# EAGLE design LAOS10105 (EAGLE 5.11)
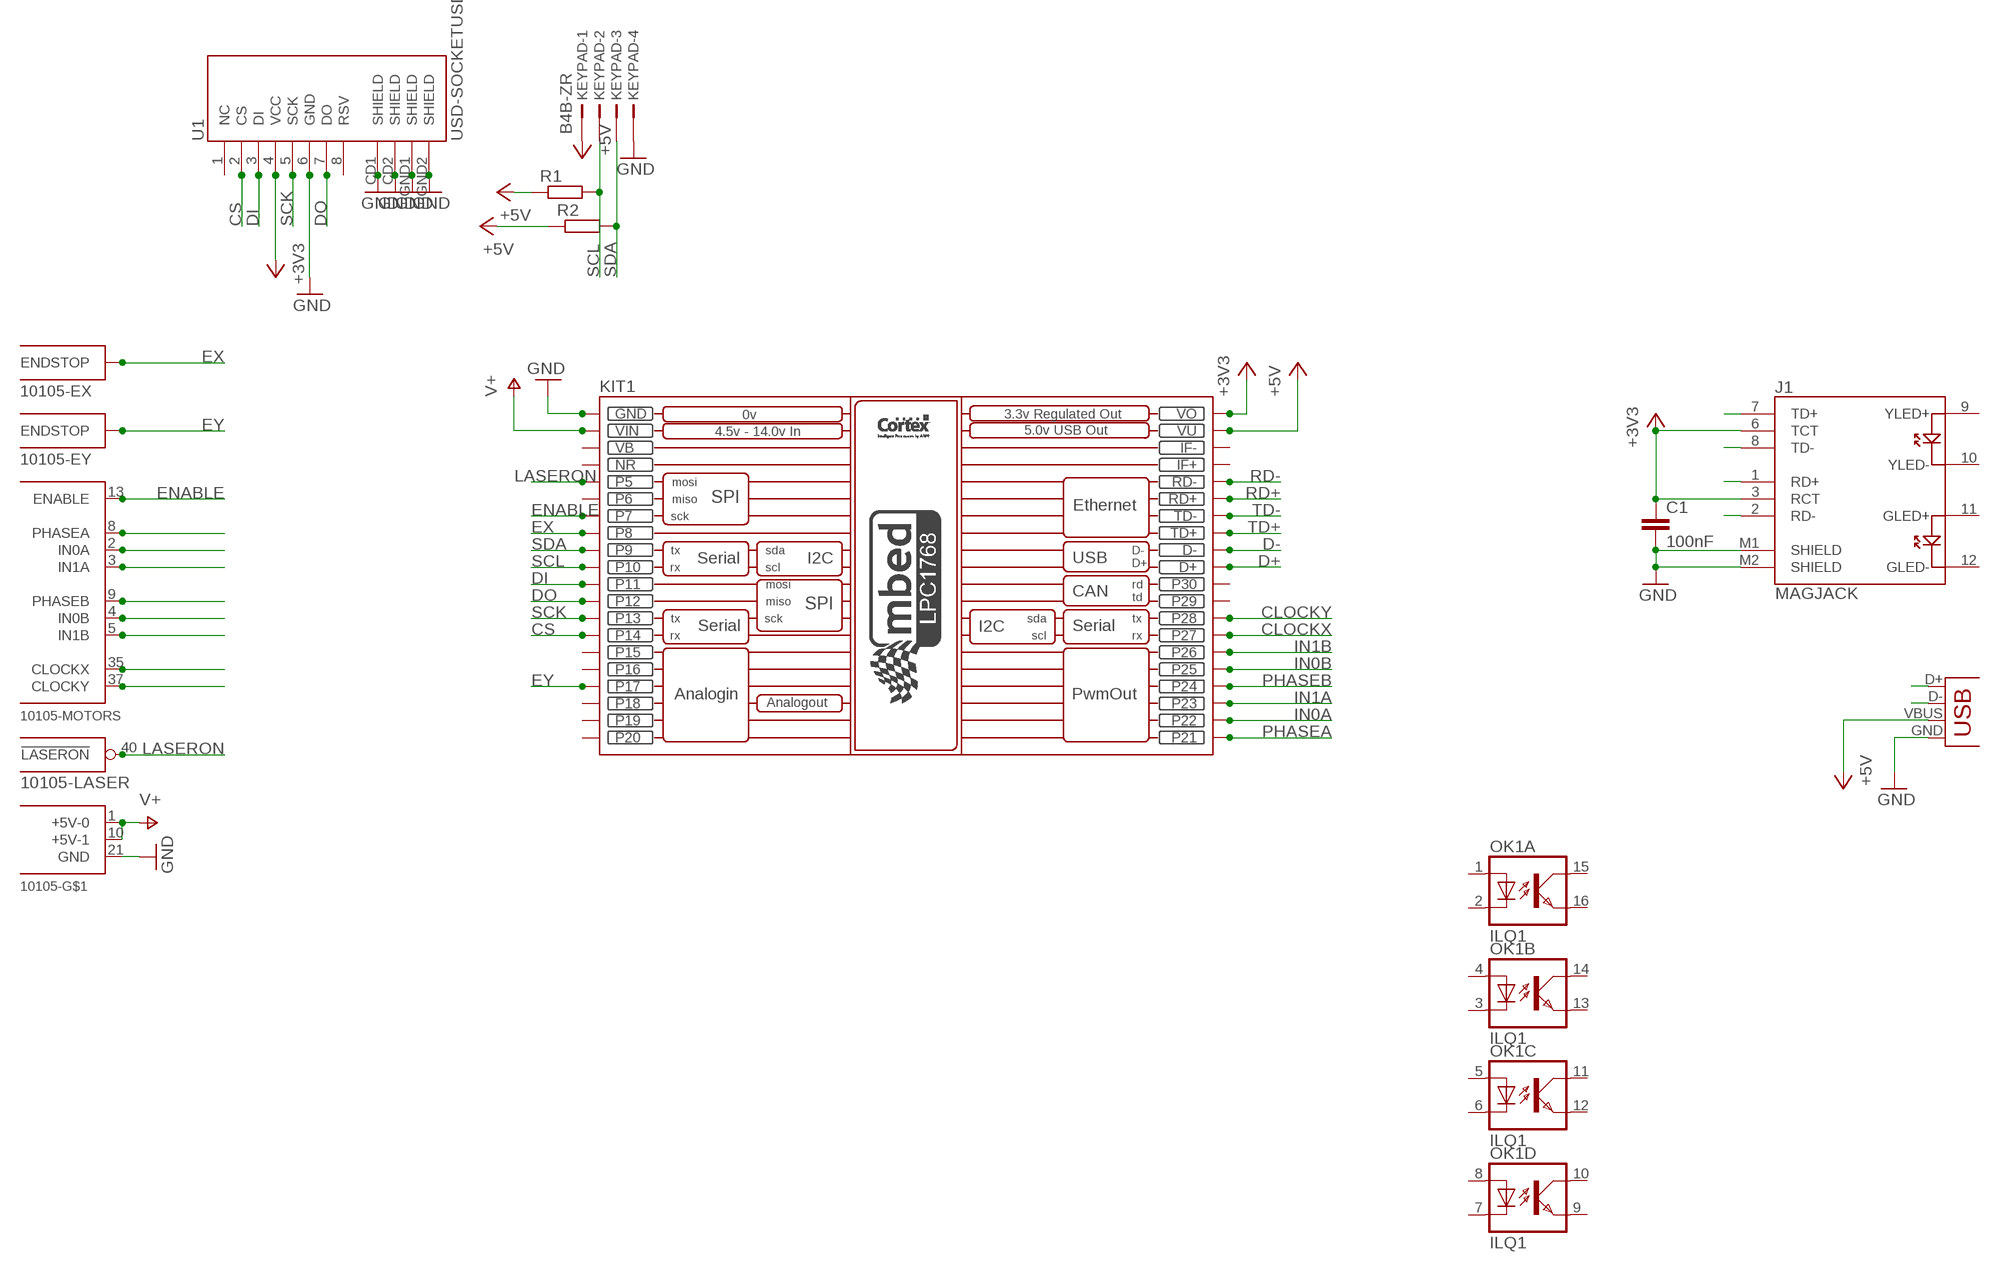
[diagram p0: schematic, sheet 1]

## Parts
10105-  MS10105  [DIL40]
C1  100nF  C-EU025-030X050  [C025-030X050]
J1  MAGJACK  [MAGJACK]
KEYPAD  B4B-ZR  [B4B-ZR]
KIT1  MBED_NXP_LPC1768  [MBED-KIT]
OK1  ILQ1  [DIL16]
R1  R-EU_0207/2V  [0207/2V]
R2  R-EU_0207/2V  [0207/2V]
U1  USD-SOCKETUSD  [USD-SOCKET-PP]
X1  USB-A-S  [USB-A-S]

## Nets
+3V3: C1.1 J1.3(RCT) J1.6(TCT) KIT1.VOUT(VO) U1.4(VCC)
+5V: KEYPAD.1 KIT1.VU R1.1 R2.1 X1.VBUS
CLOCKX: 10105-.35(MOTORS:CLOCKX) KIT1.P$27(P27)
CLOCKY: 10105-.37(MOTORS:CLOCKY) KIT1.P$28(P28)
CS: KIT1.P$14(P14) U1.2(CS)
D+: KIT1.D+ X1.D+
D-: KIT1.D- X1.D-
DI: KIT1.P$11(P11) U1.3(DI)
DO: KIT1.P$12(P12) U1.7(DO)
ENABLE: 10105-.13(MOTORS:ENABLE) KIT1.P$7(P7)
EX: 10105-.38(EX:ENDSTOP) KIT1.P$8(P8)
EY: 10105-.39(EY:ENDSTOP) KIT1.P$17(P17)
GND: 10105-.21(GND) C1.2 J1.M1(SHIELD) J1.M2(SHIELD) KEYPAD.4 KIT1.GND U1.6(GND) U1.CD1(SHIELD) U1.CD2(SHIELD) U1.GND1(SHIELD) U1.GND2(SHIELD) X1.GND
IN0A: 10105-.2(MOTORS:IN0A) KIT1.P$22(P22)
IN0B: 10105-.4(MOTORS:IN0B) KIT1.P$25(P25)
IN1A: KIT1.P$23(P23)
IN1B: 10105-.5(MOTORS:IN1B) KIT1.P$26(P26)
LASERON: 10105-.40(LASER:!LASERON) KIT1.P$5(P5)
N$1: 10105-.3(MOTORS:IN1A)
PHASEA: 10105-.8(MOTORS:PHASEA) KIT1.P$21(P21)
PHASEB: 10105-.9(MOTORS:PHASEB) KIT1.P$24(P24)
RD+: J1.1(RD+) KIT1.RD+
RD-: J1.2(RD-) KIT1.RD-
SCK: KIT1.P$13(P13) U1.5(SCK)
SCL: KEYPAD.2 KIT1.P$10(P10) R1.2
SDA: KEYPAD.3 KIT1.P$9(P9) R2.2
TD+: J1.7(TD+) KIT1.TD+
TD-: J1.8(TD-) KIT1.TD-
V+: 10105-.1(+5V-0) 10105-.10(+5V-1) KIT1.VIN
Unconnected: J1.9(YLED+) J1.10(YLED-) J1.11(GLED+) J1.12(GLED-) KIT1.IF+ KIT1.IF- KIT1.P$6(P6) KIT1.P$15(P15) KIT1.P$16(P16) KIT1.P$18(P18) KIT1.P$19(P19) KIT1.P$20(P20) KIT1.P$29(P29) KIT1.P$30(P30) OK1.1(A:A) OK1.2(A:C) OK1.3(B:C) OK1.4(B:A) OK1.5(C:A) OK1.6(C:C) OK1.7(D:C) OK1.8(D:A) OK1.9(D:EMIT) OK1.10(D:COL) OK1.11(C:COL) OK1.12(C:EMIT) OK1.13(B:EMIT) OK1.14(B:COL) OK1.15(A:COL) OK1.16(A:EMIT) U1.1(NC) U1.8(RSV)

## Power pins joined to a net without a drawn wire
NR: KIT1.NR
VB: KIT1.VB

## Library data of the parts
10105- = ms10105:MS10105
C1 = rcl:C-EU: CAPACITOR, European symbol
J1 = SparkFun:MAGJACK
KEYPAD = con-jst:?4B-ZR: ZH CONNECTOR 1.5 mm, 4 pin 1 row Source: http://www.jst.com .. eZH.pdf; MF: FARNELL; MPN: B4B-ZR(LF)(SN); OC_FARNELL: 1830916; OC_NEWARK: 37K9960
KIT1 = MBED_v2.1:MBED_NXP_LPC1768: Mbed LPC1768 - ARM CORTEX v2.1 * Schematic symbol is now placed in eagles's default raster. *The pads diameter are suitable for routing between mbed pins * mbed pads are 0.8 mm drill diameter. --------------------------------------------- Created by: Mohamed Yousry *Alexandria, Egypt *Email: mohamed.yousry@ieeegoldegypt.org
OK1 = optocoupler:ILQ1: SIEMENS OPTO COUPLER; MF: VISHAY/TELEFUNKEN; MPN: ILQ1; OC_FARNELL: 1469501; OC_NEWARK: 88K1954
R1 R2 = rcl:R-EU_: RESISTOR, European symbol
U1 = SparkFun:USD-SOCKET: microSD Socket Push-push type uSD socket. Schematic element and footprint production proven. Spark Fun Electronics SKU : PRT-00127. tDoc lines correctly indicate media card edge positions when inserting (unlocked, locked, depressed).
X1 = SparkFun:USB: USB Connectors USB-B-PTH is fully proven SKU : PRT-00139 USB-miniB is fully proven SKU : PRT-00587 USB-A-PCB is untested. USB-A-H is throughly reviewed, but untested. Spark Fun Electronics SKU : PRT-00437 USB-B-SMT is throughly reviewed, but untested. Needs silkscreen touching up. USB-A-S has not been used/tested USB-MB-H has not been used/tested

## Board
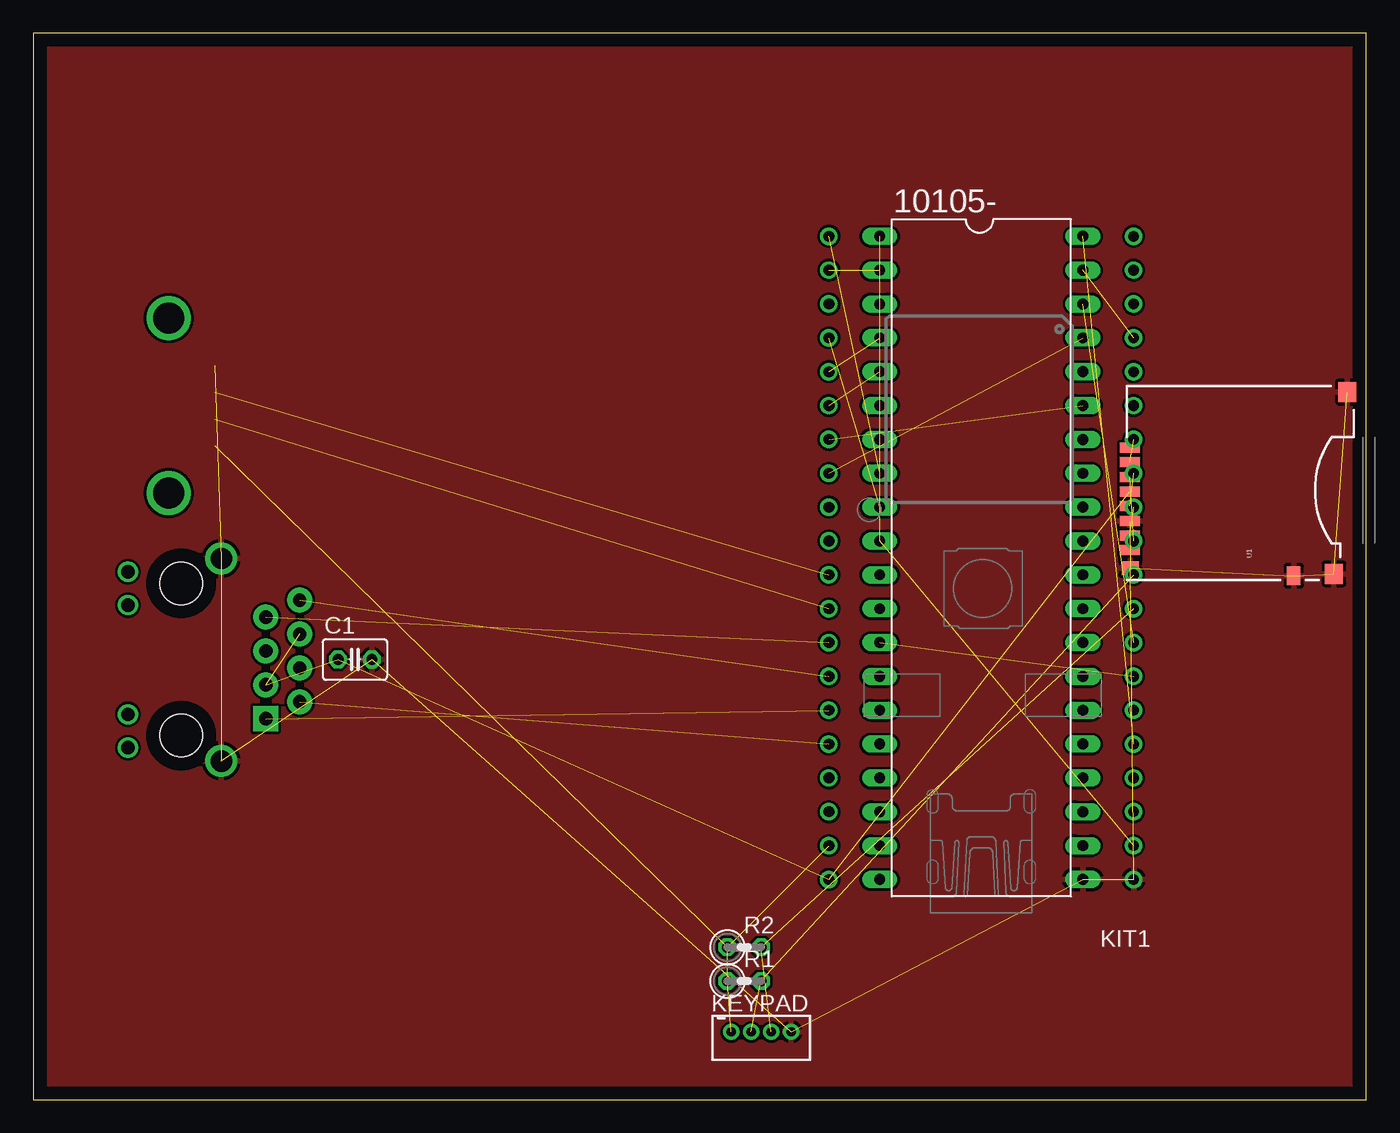
[diagram p1: board, top side]
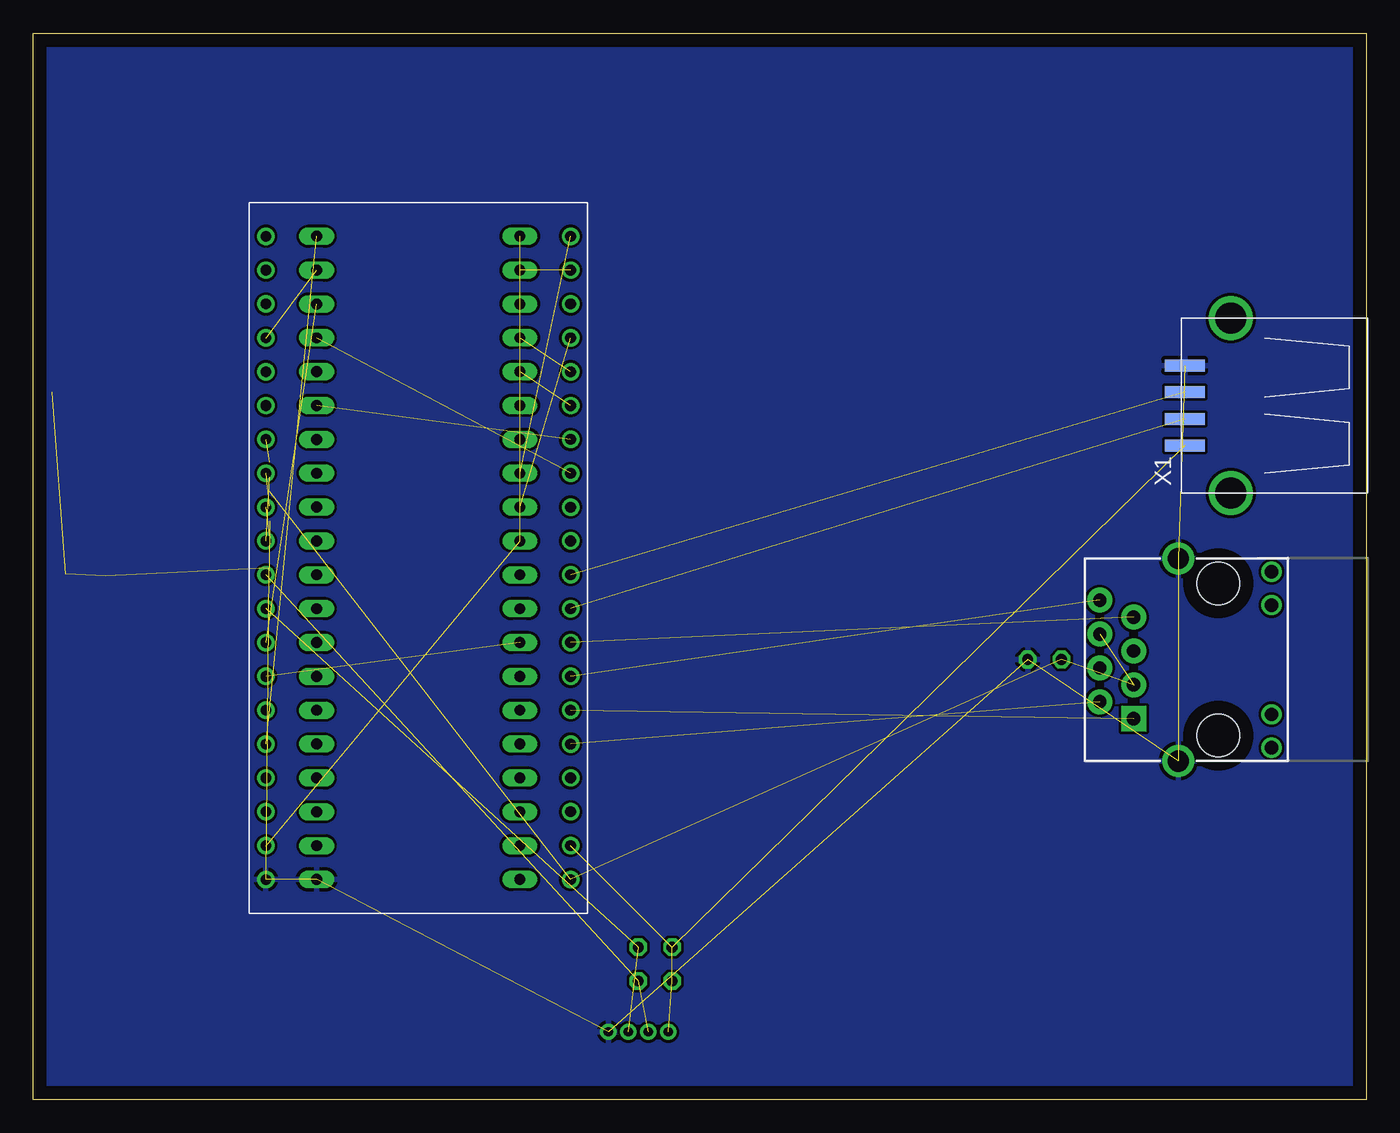
[diagram p2: board, bottom side, seen from below]

Size 100 x 80 mm. Coordinates in mm from the lower left corner, seen from the top.
Outline: 0,0 100,0 100,80 0,80 0,0
Copper layers (1*16): Top 0.035mm / dielectric 1.5mm / Bottom 0.035mm
Design rules "default": minimum track width 10mil, minimum drill 0.6mm, track to track 8mil, track to pad 8mil, pad to pad 8mil, via to via 8mil, smd to smd 8mil, copper to edge 40mil, drill to drill 8mil, minimum pad ring 10mil, minimum via ring 8mil, stop-mask expansion 4mil, vias tented up to drill 0mil, thermal gap 10mil

### Footprints (pad centres in the part's own frame; a part is rotated, then mirrored left to right if it is on the bottom)
DIL40 = drill 0.813 long: 1 -24.13,-7.62; 2 -21.59,-7.62; 3 -19.05,-7.62; 4 -16.51,-7.62; 5 -13.97,-7.62; 6 -11.43,-7.62; 7 -8.89,-7.62; 8 -6.35,-7.62; 9 -3.81,-7.62; 10 -1.27,-7.62; 11 1.27,-7.62; 12 3.81,-7.62; 13 6.35,-7.62; 14 8.89,-7.62; 15 11.43,-7.62; 16 13.97,-7.62; 17 16.51,-7.62; 18 19.05,-7.62; 19 21.59,-7.62; 20 24.13,-7.62; 21 24.13,7.62; 22 21.59,7.62; 23 19.05,7.62; 24 16.51,7.62; 25 13.97,7.62; 26 11.43,7.62; 27 8.89,7.62; 28 6.35,7.62; 29 3.81,7.62; 30 1.27,7.62; 31 -1.27,7.62; 32 -3.81,7.62; 33 -6.35,7.62; 34 -8.89,7.62; 35 -11.43,7.62; 36 -13.97,7.62; 37 -16.51,7.62; 38 -19.05,7.62; 39 -21.59,7.62; 40 -24.13,7.62
C025-030X050 = drill 0.813 octagon: 1 -1.27,0; 2 1.27,0
MAGJACK = drill 1 pad 1.88 square: 1 3.175,17.445 | drill 1 pad 1.88 round: 2 4.445,19.985; 3 5.715,17.445; 4 6.985,19.985; 5 8.255,17.445; 6 9.525,19.985; 7 10.795,17.445; 8 12.065,19.985 | drill 1 pad 1.27 round: 9 1,7.1; 10 3.5,7.1; 11 11.7,7.1; 12 14.2,7.1 | drill 1.6 pad 2.184 round: M1 0,14.1; M2 15.2,14.1 | hole 3.2: 1.905,11.095; 13.335,11.095
B4B-ZR = drill 0.7 pad 1.1 round: 1 -2.25,0; 2 -0.75,0; 3 0.75,0; 4 2.25,0
MBED-KIT = drill 0.8 round: D+ 11.43,1.27; D- 11.43,3.81; GND -11.43,24.13; IF+ 11.43,16.51; IF- 11.43,19.05; NR -11.43,16.51; P$5 -11.43,13.97; P$6 -11.43,11.43; P$7 -11.43,8.89; P$8 -11.43,6.35; P$9 -11.43,3.81; P$10 -11.43,1.27; P$11 -11.43,-1.27; P$12 -11.43,-3.81; P$13 -11.43,-6.35; P$14 -11.43,-8.89; P$15 -11.43,-11.43; P$16 -11.43,-13.97; P$17 -11.43,-16.51; P$18 -11.43,-19.05; P$19 -11.43,-21.59; P$20 -11.43,-24.13; P$21 11.43,-24.13; P$22 11.43,-21.59; P$23 11.43,-19.05; P$24 11.43,-16.51; P$25 11.43,-13.97; P$26 11.43,-11.43; P$27 11.43,-8.89; P$28 11.43,-6.35; P$29 11.43,-3.81; P$30 11.43,-1.27; RD+ 11.43,11.43; RD- 11.43,13.97; TD+ 11.43,6.35; TD- 11.43,8.89; VB -11.43,19.05; VIN -11.43,21.59; VOUT 11.43,24.13; VU 11.43,21.59
0207/2V = drill 0.813 octagon: 1 -1.27,0; 2 1.27,0
USD-SOCKET-PP = smd 0.75 x 1.5: 1 3.2,16.8; 2 2.1,16.8; 3 1,16.8; 4 -0.1,16.8; 5 -1.2,16.8; 6 -2.3,16.8; 7 -3.4,16.8; 8 -4.5,16.8 | smd 1 x 1.3: CD1 -5.85,16.75 | smd 1.4 x 1: CD2 -6.425,4.5 | smd 1.5 x 1.35: GND1 -6.275,1.475; GND2 7.375,0.475
USB-A-S = smd 3 x 0.9: D+ 3.45,-1; D- 3.45,1; GND 3.45,-3; VBUS 3.45,3 | drill 2.311 round: P$5 0,-6.566; P$6 0,6.566

### Placement (x,y rotation side)
10105-  71.12,40.64 270 top
C1  24.13,33.02 0 top
J1  0,25.4 90 bottom
KEYPAD  54.61,5.08 0 top
KIT1  71.12,40.64 180 top
R1  53.34,8.89 0 top
R2  53.34,11.43 0 top
U1  99.06,45.72 90 top
X1  10.16,52.07 180 bottom

### Tracks (layer width: path | path; a pad name or v marks a point on that pad's centre or on a via)
+3V3  (4 unrouted)
+5V  (4 unrouted)
CLOCKX  (1 unrouted)
CLOCKY  (1 unrouted)
CS  (1 unrouted)
D+  (1 unrouted)
D-  (1 unrouted)
DI  (1 unrouted)
DO  (1 unrouted)
ENABLE  (1 unrouted)
EX  (1 unrouted)
EY  (1 unrouted)
GND  (11 unrouted)
  pour Bottom: -1.27,81.28 102.87,81.28 102.87,-5.08 -1.27,-5.08
  pour Top: -1.27,83.82 101.6,83.82 101.6,-2.54 -1.27,-2.54
IN0A  (1 unrouted)
IN0B  (1 unrouted)
IN1B  (1 unrouted)
LASERON  (1 unrouted)
PHASEA  (1 unrouted)
PHASEB  (1 unrouted)
RD+  (1 unrouted)
RD-  (1 unrouted)
SCK  (1 unrouted)
SCL  (2 unrouted)
SDA  (2 unrouted)
TD+  (1 unrouted)
TD-  (1 unrouted)
V+  (2 unrouted)